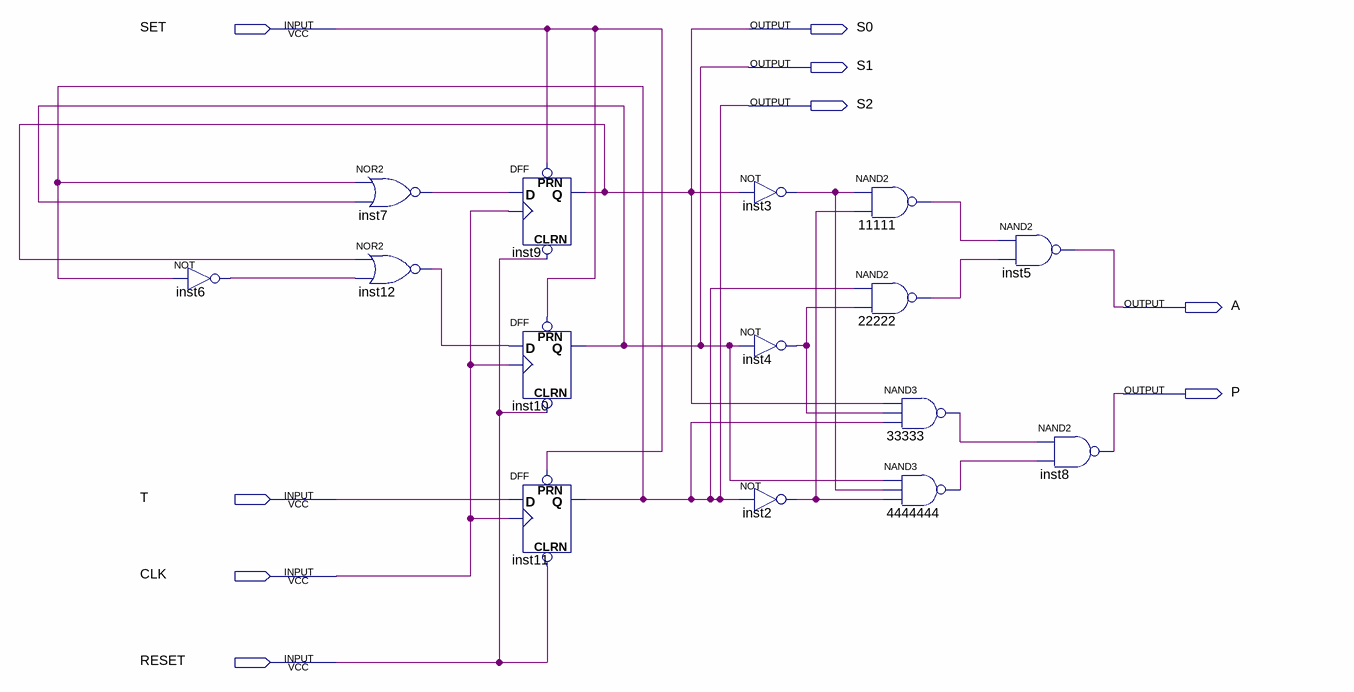
[diagram p0: schematic sheet]
// Quartus schematic 1234.bdf as structural Verilog: 15 symbols, 9 pins
module \1234  (
  input  SET,
  input  T,
  input  CLK,
  input  RESET,
  output S0,
  output S1,
  output S2,
  output A,
  output P
);

  wire inst2_out, inst3_out, inst4_out, inst6_out, inst7_out, inst12_out, n11111_out, n22222_out, n33333_out,
       n4444444_out;

  not inst6 (inst6_out, S2);
  nor inst7 (inst7_out, S2, S1);
  nor inst12 (inst12_out, S0, inst6_out);
  DFF inst9 (.CLRN(RESET), .CLK(CLK), .D(inst7_out), .PRN(SET), .Q(S0));
  DFF inst10 (.CLRN(RESET), .CLK(CLK), .D(inst12_out), .PRN(SET), .Q(S1));
  DFF inst11 (.CLRN(RESET), .CLK(CLK), .D(T), .PRN(SET), .Q(S2));
  not inst3 (inst3_out, S0);
  not inst4 (inst4_out, S1);
  not inst2 (inst2_out, S2);
  nand u_11111 (n11111_out, inst3_out, inst2_out);
  nand u_22222 (n22222_out, S2, inst4_out);
  nand u_33333 (n33333_out, S0, inst4_out, S2);
  nand u_4444444 (n4444444_out, S1, inst3_out, inst2_out);
  nand inst5 (A, n11111_out, n22222_out);
  nand inst8 (P, n33333_out, n4444444_out);
endmodule
